# Altium schematic sheet VMux_CPU.SchDoc
size A4; DocumentNumber: 2; SheetNumber: 2; SheetTotal: 5
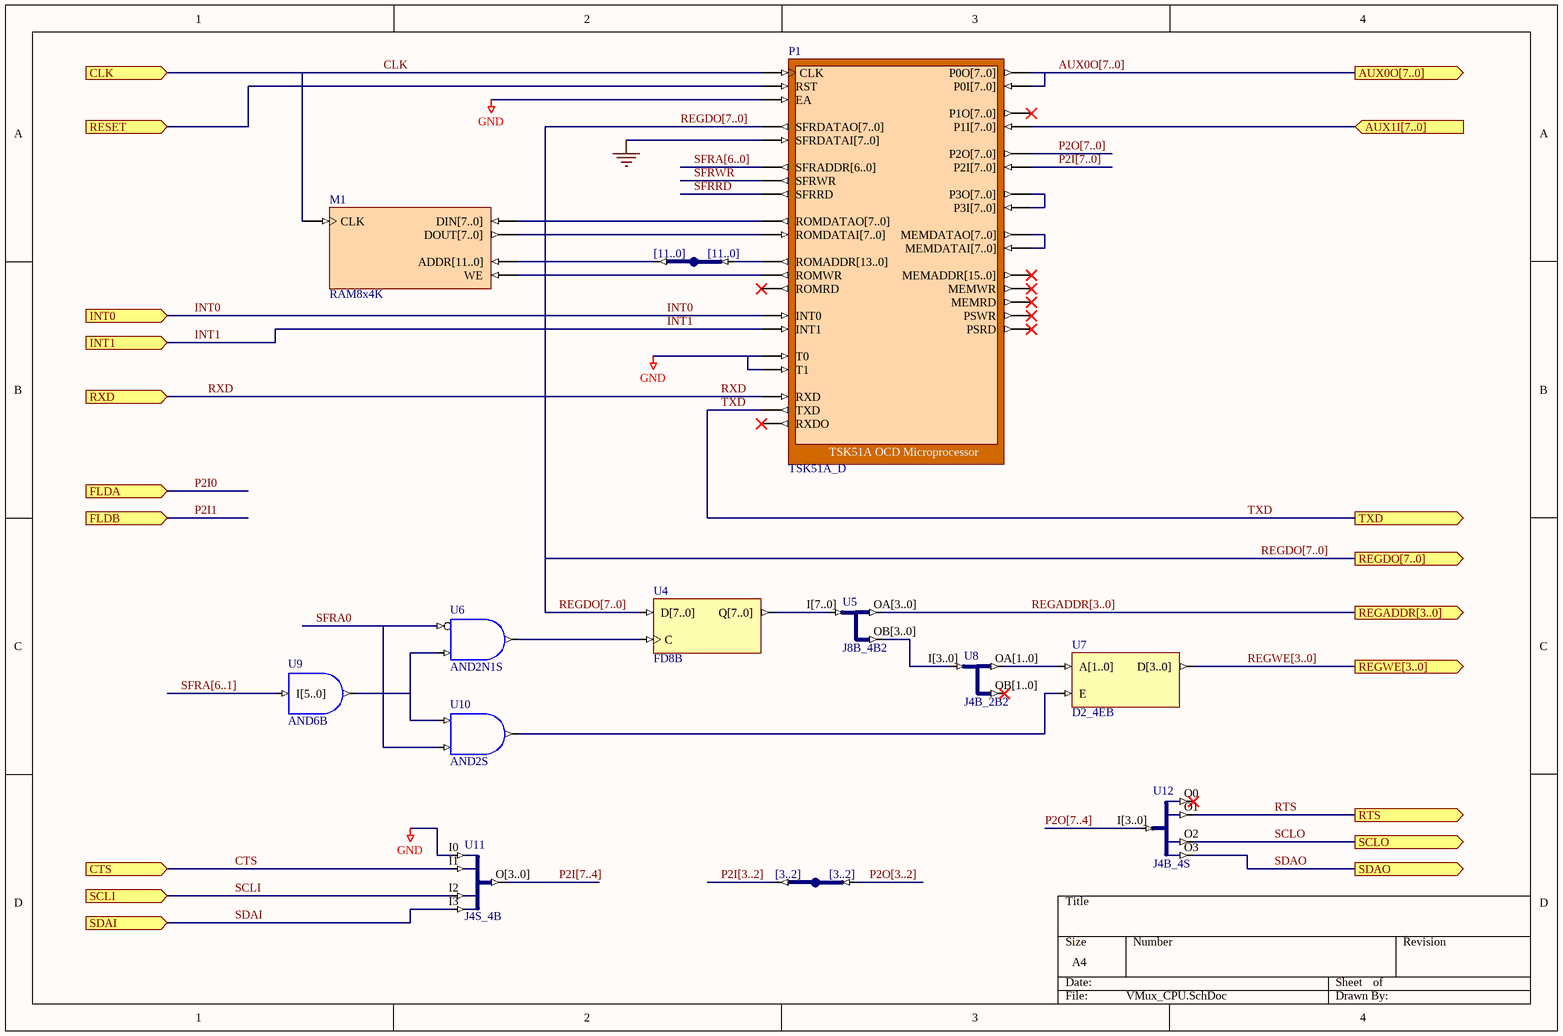
[diagram p0: VMux_CPU.SchDoc]

## Parts
M1  RAM8x4K
P1  TSK51A_D
U2  IndexA: [11..0]  (hidden comment: JB)
U3  IndexA: [3..2]  (hidden comment: JB)
U4  FD8B
U5  J8B_4B2
U6  AND2N1S
U7  D2_4EB
U8  J4B_2B2
U9  AND6B
U10  AND2S
U11  J4S_4B
U12  J4B_4S

## Ports
AUX0O[7..0] (out), AUX1I[7..0] (in), CLK (in), CTS (in), FLDA (in), FLDB (in), INT0 (in), INT1 (in), REGADDR[3..0] (out), REGDO[7..0] (out), REGWE[3..0] (out), RESET (in), RTS (out), RXD (in), SCLI (in), SCLO (out), SDAI (in), SDAO (out), TXD (out)

## Nets
GND: P1.EA P1.T0 P1.T1 U11.I0
GNDBUS[..]: P1.SFRDATAI[7..0]
AUX0O[7..0]: P1.P0I[7..0] P1.P0O[7..0] ; port AUX0O[7..0]
AUX1I[7..0]: P1.P1I[7..0] ; port AUX1I[7..0]
CLK: M1.CLK P1.CLK ; port CLK
CTS: U11.I1 ; port CTS
INT0: P1.INT0 ; port INT0
INT1: P1.INT1 ; port INT1
P2I0: port FLDA
P2I1: port FLDB
P2I[3..2]: U3.A[0..0](IA[0..0])
P2I[7..0]: P1.P2I[7..0]
P2I[7..4]: U11.O[3..0]
P2O[3..2]: U3.B[0..0]
P2O[7..0]: P1.P2O[7..0]
P2O[7..4]: U12.I[3..0]
REGADDR[3..0]: U5.OA[3..0] ; port REGADDR[3..0]
REGDO[7..0]: P1.SFRDATAO[7..0] U4.D[7..0] ; port REGDO[7..0]
REGWE[3..0]: U7.D[3..0] ; port REGWE[3..0]
RESET: P1.RST ; port RESET
RTS: U12.O1 ; port RTS
RXD: P1.RXD ; port RXD
SCLI: U11.I2 ; port SCLI
SCLO: U12.O2 ; port SCLO
SDAI: U11.I3 ; port SDAI
SDAO: U12.O3 ; port SDAO
SFRA0: U6.I0 U10.I1
SFRA[6..0]: P1.SFRADDR[6..0]
SFRA[6..1]: U9.I[5..0]
SFRRD: P1.SFRRD
SFRWR: P1.SFRWR
TXD: P1.TXD ; port TXD
NetM1_ADDR[11..0]: M1.ADDR[11..0] U2.A[0..0](IA[0..0])
NetM1_DIN[7..0]: M1.DIN[7..0] P1.ROMDATAO[7..0]
NetM1_DOUT[7..0]: M1.DOUT[7..0] P1.ROMDATAI[7..0]
NetM1_WE: M1.WE P1.ROMWR
NetP1_MEMDATAI[7..0]: P1.MEMDATAI[7..0] P1.MEMDATAO[7..0]
NetP1_P3I[7..0]: P1.P3I[7..0] P1.P3O[7..0]
NetP1_ROMADDR[13..0]: P1.ROMADDR[13..0] U2.B[0..0]
NetU4_C: U4.C U6.O
NetU4_Q[7..0]: U4.Q[7..0] U5.I[7..0]
NetU5_OB[3..0]: U5.OB[3..0] U8.I[3..0]
NetU6_I1: U6.I1 U9.O U10.I0
NetU7_A[1..0]: U7.A[1..0] U8.OA[1..0]
NetU7_E: U7.E U10.O

Not connected (* = marked no-connect by the designer): P1 MEMADDR[15..0]* MEMRD* MEMWR* P1O[7..0]* PSRD* PSWR* ROMRD* RXDO*; U8 OB[1..0]*; U12 O0*

## Buses and harness runs
bus AUX0O[7..0] = port AUX0O[7..0]
bus P2I[3..2]
bus P2I[7..0]
bus P2I[7..4]
bus P2O[3..2]
bus P2O[7..0]
bus P2O[7..4]
bus REGADDR[3..0] = port REGADDR[3..0]
bus REGDO[7..0] = port REGDO[7..0]
bus REGWE[3..0] = port REGWE[3..0]
bus SFRA[6..0]
bus SFRA[6..1]

## Library data of the parts
M1 = RAM8x4K: Single Port Random Access Memory 4096 x 8; Memory_Depth: 4096; Memory_Type: RAM_SinglePortBlock; Memory_Width: 8; Memory_ClockEdge: Rising; Nexus_Core: Memory_Program; Published: 26/09/2003; Publisher: Altium Hobart Technology Center
P1 = TSK51A_D: TSK51A OCD Microprocessor; NEXUS_CORE: Processor_OCDS; NEXUS_JTAG_DEVICE: True; NEXUS_JTAG_ORDER: 0; ChildModel1: RAM256x8_TSK51D; ChildCore1: M1; Memory_Configuration: Record[NEXUS_CORE]{}ComponentDesignator[iram]{}Memory_Depth[256]{}Memory_UsageType[ram]{}ProgramDownloadAddress[0x0]{}Memory_BusType[c51:idata_bus]{n}Record[NEXUS_CORE]{}ComponentDesignator[xram]{}Memory_Depth[64k]{}Memory_UsageType[ram]{}ProgramDownloadAddress[0x0]{}Memory_BusType[c51:xdata_bus]{n}Record[NEXUS_CORE]{}ComponentDesignator[xrom]{}Memory_Depth[64k]{}Memory_UsageType[rom]{}ProgramDownloadAddress[0x0]{}Memory_BusType[c51:code_bus]{n}; Published: 23/10/2003; Publisher: Altium Hobart Technology Centre; Core Revision: 1.00.00
U2 U3 = JB: System Joiner; Class I: Bus Joiner; ArchiveName: GENERIC; Published: 18-Sep-2003; Publisher: Altium Limited
  U2: IndexB: [11..0]
  U3: IndexB: [3..2]
U4 = FD8B: 8-Bit D-Type Flip-Flop, Bus Version; Xilinx Equivalent: FD8; ArchiveName: GENERIC; Published: 18-Nov-2003; Publisher: Altium Limited; Core Revision: 1.00.00
U5 = J8B_4B2: 1 x 8-bit input bus to 2 x 4-Bit output bus; ArchiveName: GENERIC; Published: 18-Nov-2003; Publisher: Altium Limited; Core Revision: 1.00.00
U6 = AND2N1S: 2-Input AND Gate with Active Low A Input, Single Pin Version; Xilinx Equivalent: AND2B1; ArchiveName: GENERIC; Published: 18-Nov-2003; Publisher: Altium Limited; Core Revision: 1.00.00
U7 = D2_4EB: Binary 2- to 4-Bit Decoder with Enable, Bus Version; ArchiveName: GENERIC; Published: 18-Nov-2003; Publisher: Altium Limited; Core Revision: 1.00.00
U8 = J4B_2B2: 1 x 4-bit input bus to 2 x 2-Bit output bus; ArchiveName: GENERIC; Published: 18-Nov-2003; Publisher: Altium Limited; Core Revision: 1.00.00
U9 = AND6B: 6-Input AND Gate, Bus Version; ArchiveName: GENERIC; Published: 18-Nov-2003; Publisher: Altium Limited; Core Revision: 1.00.00
U10 = AND2S: 2-Input AND Gate, Single Pin Version; Xilinx Equivalent: AND2; ArchiveName: GENERIC; Published: 18-Nov-2003; Publisher: Altium Limited; Core Revision: 1.00.00
U11 = J4S_4B: 4 Single pin inputs to single 4-Bit output bus; ArchiveName: GENERIC; Published: 9-30-2003; Publisher: Altium Limited; Core Revision: 1.00.00
U12 = J4B_4S: 4-Bit input bus to 4 Single pin outputs; ArchiveName: GENERIC; Published: 9-30-2003; Publisher: Altium Limited; Core Revision: 1.00.00